# Altium schematic sheet Digital Trimmers.SchDoc
size A4; Author: Thomas Kreppel; CompanyName: Universidad de Santiago de Chile; Address1: Avenida Ecuador Nº 3519; Address2: Estación Central, Santiago; Address3: Chile; DocumentNumber: 8; SheetNumber: 8; SheetTotal: 10
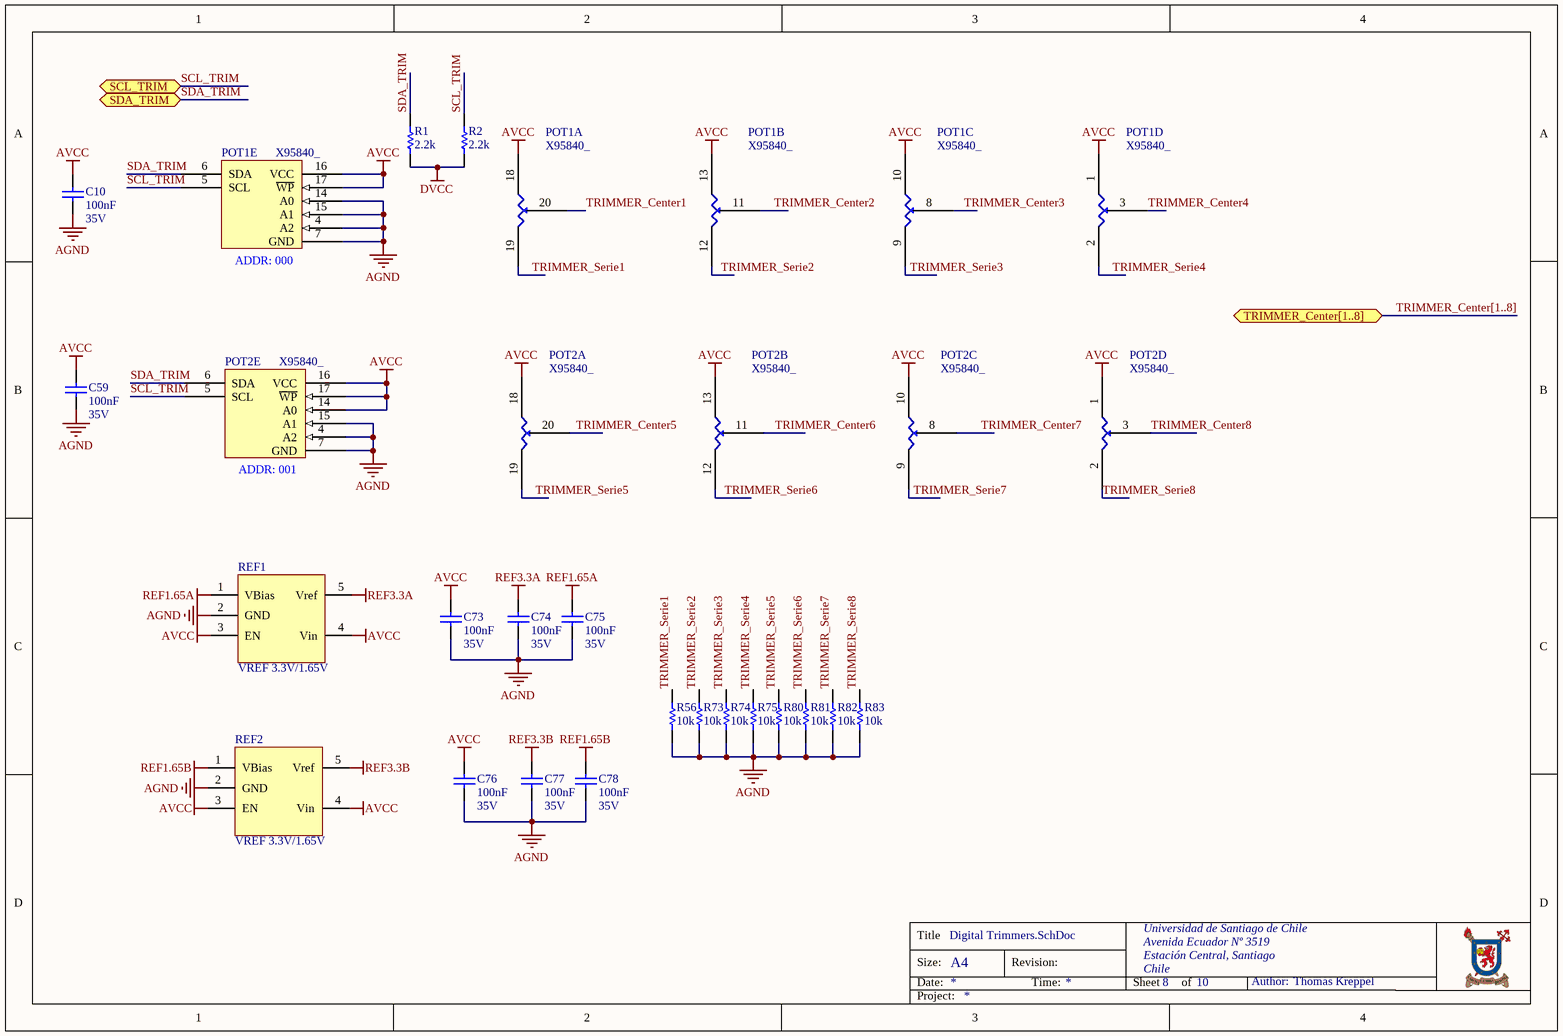
[diagram p0: Digital Trimmers.SchDoc]

## Parts
C10  100nF  Voltage: 35V  [CAP_0603]
C59  100nF  Voltage: 35V  [CAP_0603]
C73  100nF  Voltage: 35V  [CAP_0603]
C74  100nF  Voltage: 35V  [CAP_0603]
C75  100nF  Voltage: 35V  [CAP_0603]
C76  100nF  Voltage: 35V  [CAP_0603]
C77  100nF  Voltage: 35V  [CAP_0603]
C78  100nF  Voltage: 35V  [CAP_0603]
POT1  X95840_  [TSSO6X6-G20/D6.6]  (parts A,B,C,D,E of 5)
POT2  X95840_  [TSSO6X6-G20/D6.6]  (parts A,B,C,D,E of 5)
R1  2.2k  [RES_0603]
R2  2.2k  [RES_0603]
R56  10k  [RES_0603]
R73  10k  [RES_0603]
R74  10k  [RES_0603]
R75  10k  [RES_0603]
R80  10k  [RES_0603]
R81  10k  [RES_0603]
R82  10k  [RES_0603]
R83  10k  [RES_0603]
REF1  VREF 3.3V/1.65V  [SOT-23-5]
REF2  VREF 3.3V/1.65V  [SOT-23-5]

## Ports
SCL_TRIM (bidir), SDA_TRIM (bidir), TRIMMER_Center[1..8] (bidir)

## Nets
AGND: C10.2 C59.2 C73.2 C74.2 C75.2 C76.2 C77.2 C78.2 POT1.4(A2) POT1.7(GND) POT1.14(A0) POT1.15(A1) POT2.4(A2) POT2.7(GND) POT2.15(A1) R56.1 R73.1 R74.1 R75.1 R80.1 R81.1 R82.1 R83.1 REF1.2(GND) REF2.2(GND)
AVCC: C10.1 C59.1 C73.1 C76.1 POT1.1(RH3) POT1.10(RH2) POT1.13(RH1) POT1.16(VCC) POT1.17(~{WP}) POT1.18 POT2.1(RH3) POT2.10(RH2) POT2.13(RH1) POT2.14(A0) POT2.16(VCC) POT2.17(~{WP}) POT2.18 REF1.3(EN) REF1.4(Vin) REF2.3(EN) REF2.4(Vin)
DVCC: R1.1 R2.1
REF1.65A: C75.1 REF1.1(VBias)
REF1.65B: C78.1 REF2.1(VBias)
REF3.3A: C74.1 REF1.5(Vref)
REF3.3B: C77.1 REF2.5(Vref)
SCL_TRIM: POT1.5(SCL) POT2.5(SCL) R2.2 ; port SCL_TRIM
SDA_TRIM: POT1.6(SDA) POT2.6(SDA) R1.2 ; port SDA_TRIM
TRIMMER_Center1: POT1.20
TRIMMER_Center2: POT1.11(RW1)
TRIMMER_Center3: POT1.8(RW2)
TRIMMER_Center4: POT1.3(RW3)
TRIMMER_Center5: POT2.20
TRIMMER_Center6: POT2.11(RW1)
TRIMMER_Center7: POT2.8(RW2)
TRIMMER_Center8: POT2.3(RW3)
TRIMMER_Serie1: POT1.19 R56.2
TRIMMER_Serie2: POT1.12(RL1) R73.2
TRIMMER_Serie3: POT1.9(RL2) R74.2
TRIMMER_Serie4: POT1.2(RL3) R75.2
TRIMMER_Serie5: POT2.19 R80.2
TRIMMER_Serie6: POT2.12(RL1) R81.2
TRIMMER_Serie7: POT2.9(RL2) R82.2
TRIMMER_Serie8: POT2.2(RL3) R83.2

## Buses and harness runs
bus TRIMMER_Center[1..8] = port TRIMMER_Center[1..8]

## Notes on the sheet
- (near POT1) ADDR: 000
- (near POT2) ADDR: 001
- Title
- Size:
- Date:
- A4
- Revision:
- Time:
- Sheet
- of
- Author:
- Project:

## Library data of the parts
C10 C59 C73-C78 = Cap_0603: Capacitor; MPN: C0603C104M5RACTU; Rule: PcbType=ProtelPcb; MF: KEMET; Dielectricum: X7R; Tolerance: 10%; Published: 8-Jun-2000; LatestRevisionDate: 17-Jul-2002; LatestRevisionNote: Re-released for DXP Platform.; PackageReference: RAD-0.3; Publisher: Altium Limited; Value: 100nF; Supplier 1: Digikey; Supplier 2: Mouser; Supplier Part Number 1: 399-7845-1-ND; Package: 0603
POT1 POT2 = X95840_: Digital Trimmer; Manufacturer Part-Number: X95840WV20IZ-2.7; Supplier 1: Digikey; Supplier 2: Mouser; Supplier Part Number 1: X95840WV20IZ-2.7-ND
R1 R2 = Res0603: MPN: RC0603FR-072K2L; Tolerance: 1%; Published: 8-Jun-2000; LatestRevisionDate: 17-Jul-2002; LatestRevisionNote: Re-released for DXP Platform.; PackageReference: AXIAL-0.3; Publisher: Altium Limited; PackageDescription: Axial Device, Thru-Hole; 2 Leads; 0.3 in Pin Spacing; Value: 2.2k; Supplier 1: Digikey; Supplier 2: Mouser; Supplier Part Number 1: 311-2.20KHRCT-ND; Package: 0603
R56 R73-R75 R80-R83 = Res0603: Manufacturer Part-Number: RT0603DRD0710KL; Tolerance: 1%; Published: 8-Jun-2000; LatestRevisionDate: 17-Jul-2002; LatestRevisionNote: Re-released for DXP Platform.; PackageReference: AXIAL-0.3; Publisher: Altium Limited; PackageDescription: Axial Device, Thru-Hole; 2 Leads; 0.3 in Pin Spacing; Value: 10k; Supplier 1: Digikey; Supplier 2: Mouser; Supplier Part Number 1: 311-10KDCT-ND; Package: 0603
REF1 REF2 = VREF 3.3V/1.65V: Manufacturer Part-Number: REF2033AIDDCT; Supplier 1: Digikey; Supplier 2: Mouser; Supplier Part Number 1: 296-40487-1-ND